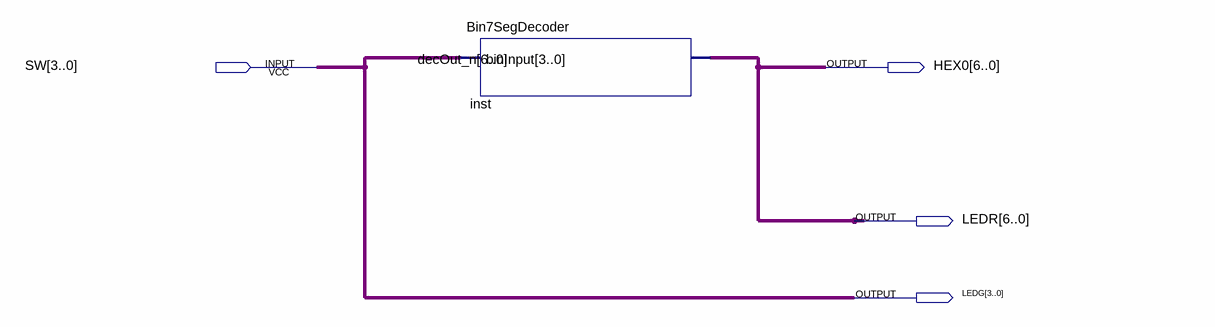
[diagram p0: schematic sheet]
// Quartus schematic DisplayDemo.bdf as structural Verilog: 1 symbols, 4 pins
module DisplayDemo (
  input  [3:0] SW,
  output [6:0] HEX0,
  output [6:0] LEDR,
  output [3:0] LEDG
);

  Bin7SegDecoder inst (.binInput(SW), .decOut_n(HEX0));

  assign LEDG = SW;
  assign LEDR = HEX0;
endmodule
